# EAGLE design 504_outin_chirimen (EAGLE 9.6.2)
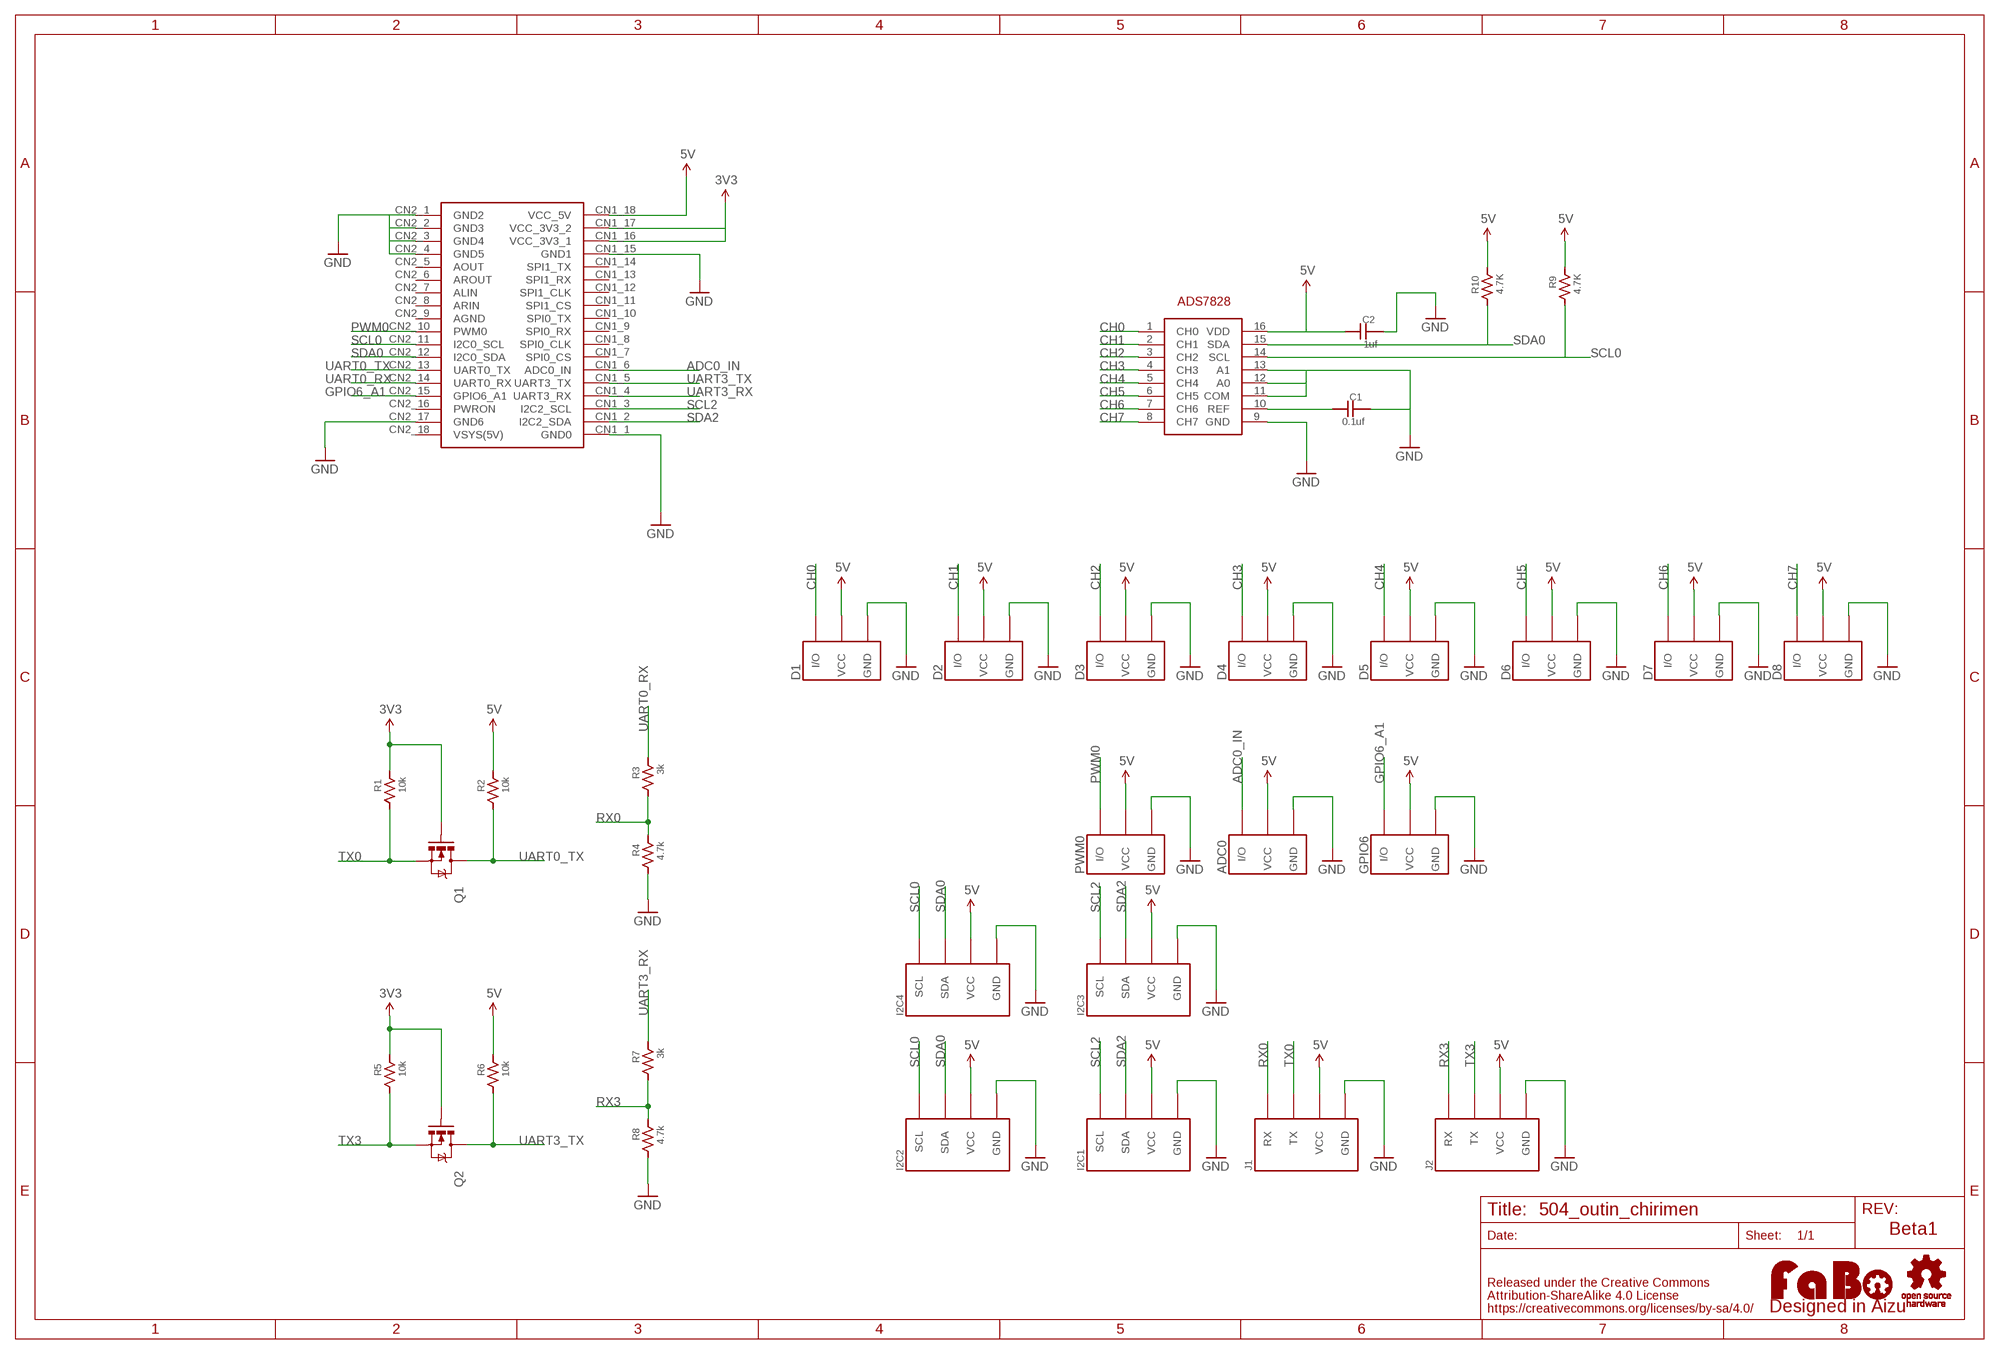
[diagram p0: schematic, sheet 1]

## Parts
ADC0  FABO_BRICK_3PIN-HEADER  [FABO_BRICK_3PIN_HEADER]
C1  0.1uf  CAPACITOR0402  [0402]
C2  1uf  CAPACITOR0402  [0402]
D1  FABO_BRICK_3PIN-B03B-PASK-1_SILK  [FABO_BRICK_3PIN_B03B-PASK-1_SILK]
D2  FABO_BRICK_3PIN-B03B-PASK-1_SILK  [FABO_BRICK_3PIN_B03B-PASK-1_SILK]
D3  FABO_BRICK_3PIN-B03B-PASK-1_SILK  [FABO_BRICK_3PIN_B03B-PASK-1_SILK]
D4  FABO_BRICK_3PIN-B03B-PASK-1_SILK  [FABO_BRICK_3PIN_B03B-PASK-1_SILK]
D5  FABO_BRICK_3PIN-B03B-PASK-1_SILK  [FABO_BRICK_3PIN_B03B-PASK-1_SILK]
D6  FABO_BRICK_3PIN-B03B-PASK-1_SILK  [FABO_BRICK_3PIN_B03B-PASK-1_SILK]
D7  FABO_BRICK_3PIN-B03B-PASK-1_SILK  [FABO_BRICK_3PIN_B03B-PASK-1_SILK]
D8  FABO_BRICK_3PIN-B03B-PASK-1_SILK  [FABO_BRICK_3PIN_B03B-PASK-1_SILK]
GPIO6  FABO_BRICK_3PIN-HEADER  [FABO_BRICK_3PIN_HEADER]
I2C1  FABO_BRICK_I2C-B04B-PASK-1_SILK  [FABO_BRICK_I2C_B04B-PASK-1_SILK]
I2C2  FABO_BRICK_I2C-B04B-PASK-1_SILK  [FABO_BRICK_I2C_B04B-PASK-1_SILK]
I2C3  FABO_BRICK_I2C-B04B-PASK-1_SILK  [FABO_BRICK_I2C_B04B-PASK-1_SILK]
I2C4  FABO_BRICK_I2C-B04B-PASK-1_SILK  [FABO_BRICK_I2C_B04B-PASK-1_SILK]
IC  TI-ADS7828  [TI-ADS7828]
J1  FABO_BRICK_SERIAL-S04B-PASK-2_SILK  [FABO_BRICK_SERIAL_S04B-PASK-2_SILK]
J2  FABO_BRICK_SERIAL-S04B-PASK-2_SILK  [FABO_BRICK_SERIAL_S04B-PASK-2_SILK]
LOGO1  LOGO_FABO-M  [LOGO_FABO_M]
PWM0  FABO_BRICK_3PIN-HEADER  [FABO_BRICK_3PIN_HEADER]
Q1  MOSFET-N-BSS138  [SOT23-3]
Q2  MOSFET-N-BSS138  [SOT23-3]
R1  10k  RESISTOR-0402  [0402]
R2  10k  RESISTOR-0402  [0402]
R3  3k  RESISTOR-0402  [0402]
R4  4.7k  RESISTOR-0402  [0402]
R5  10k  RESISTOR-0402  [0402]
R6  10k  RESISTOR-0402  [0402]
R7  3k  RESISTOR-0402  [0402]
R8  4.7k  RESISTOR-0402  [0402]
R9  4.7K  RESISTOR-0402  [0402]
R10  4.7K  RESISTOR-0402  [0402]
U$2  FABO-CHIRIMEN  [FABO-CHIRIMEN]
U$3  LOGO_OSHW-M_BOTTOM  [LOGO_OSHW_M_BOTTOM]

## Nets
3V3: Q1.1(G) Q2.1(G) R1.P$2 R5.P$2 U$2.CN1_16(VCC_3V3_1) U$2.CN1_17(VCC_3V3_2)
5V: ADC0.VCC C2.P$1 D1.VCC D2.VCC D3.VCC D4.VCC D5.VCC D6.VCC D7.VCC D8.VCC GPIO6.VCC I2C1.VCC I2C2.VCC I2C3.VCC I2C4.VCC IC.16(VDD) J1.VCC J2.VCC PWM0.VCC R2.P$2 R6.P$2 R9.P$2 R10.P$2 U$2.CN1_18(VCC_5V)
ADC0_IN: ADC0.I/O U$2.CN1_6(ADC0_IN)
CH0: D1.I/O IC.1(CH0)
CH1: D2.I/O IC.2(CH1)
CH2: D3.I/O IC.3(CH2)
CH3: D4.I/O IC.4(CH3)
CH4: D5.I/O IC.5(CH4)
CH5: D6.I/O IC.6(CH5)
CH6: D7.I/O IC.7(CH6)
CH7: D8.I/O IC.8(CH7)
GND: ADC0.GND C1.P$2 C2.P$2 D1.GND D2.GND D3.GND D4.GND D5.GND D6.GND D7.GND D8.GND GPIO6.GND I2C1.GND I2C2.GND I2C3.GND I2C4.GND IC.9(GND) IC.11(COM) IC.12(A0) IC.13(A1) J1.GND J2.GND PWM0.GND R4.P$1 R8.P$1 U$2.CN1_1(GND0) U$2.CN1_15(GND1) U$2.CN2_1(GND2) U$2.CN2_2(GND3) U$2.CN2_3(GND4) U$2.CN2_4(GND5) U$2.CN2_17(GND6)
GPIO6_A1: GPIO6.I/O U$2.CN2_15(GPIO6_A1)
N$3: C1.P$1 IC.10(REF)
PWM0: PWM0.I/O U$2.CN2_10(PWM0)
RX0: J1.RX R3.P$1 R4.P$2
RX3: J2.RX R7.P$1 R8.P$2
SCL0: I2C2.SCL I2C4.SCL IC.14(SCL) R9.P$1 U$2.CN2_11(I2C0_SCL)
SCL2: I2C1.SCL I2C3.SCL U$2.CN1_3(I2C2_SCL)
SDA0: I2C2.SDA I2C4.SDA IC.15(SDA) R10.P$1 U$2.CN2_12(I2C0_SDA)
SDA2: I2C1.SDA I2C3.SDA U$2.CN1_2(I2C2_SDA)
TX0: J1.TX Q1.2(S) R1.P$1
TX3: J2.TX Q2.2(S) R5.P$1
UART0_RX: R3.P$2 U$2.CN2_14(UART0_RX)
UART0_TX: Q1.3(D) R2.P$1 U$2.CN2_13(UART0_TX)
UART3_RX: R7.P$2 U$2.CN1_4(UART3_RX)
UART3_TX: Q2.3(D) R6.P$1 U$2.CN1_5(UART3_TX)
Unconnected: U$2.CN1_7(SPI0_CS) U$2.CN1_8(SPI0_CLK) U$2.CN1_9(SPI0_RX) U$2.CN1_10(SPI0_TX) U$2.CN1_11(SPI1_CS) U$2.CN1_12(SPI1_CLK) U$2.CN1_13(SPI1_RX) U$2.CN1_14(SPI1_TX) U$2.CN2_5(AOUT) U$2.CN2_6(AROUT) U$2.CN2_7(ALIN) U$2.CN2_8(ARIN) U$2.CN2_9(AGND) U$2.CN2_16(PWRON) U$2.CN2_18(VSYS(5V))

## Notes on the sheet
- Beta1

## Library data of the parts
ADC0 D1-D8 GPIO6 PWM0 = FaBo-Template:FABO_BRICK_3PIN: FaBo Brick 3pin
C1 C2 = FaBo-Capacitor:CAPACITOR: CAPACITOR
I2C1-I2C4 = FaBo-Template:FABO_BRICK_I2C: FaBo Brick I2C
IC = FaBo-ADC:TI-ADS7828
J1 J2 = FaBo-Template:FABO_BRICK_SERIAL: FaBo Brick Serial
LOGO1 = component:LOGO_FABO
Q1 Q2 = FaBo-etc:MOSFET-N
R1-R10 = FaBo-Resistors:RESISTOR: RESISTOR
U$2 = FaBo-Template:FABO-CHIRIMEN
U$3 = component:LOGO_OSHW

## Board
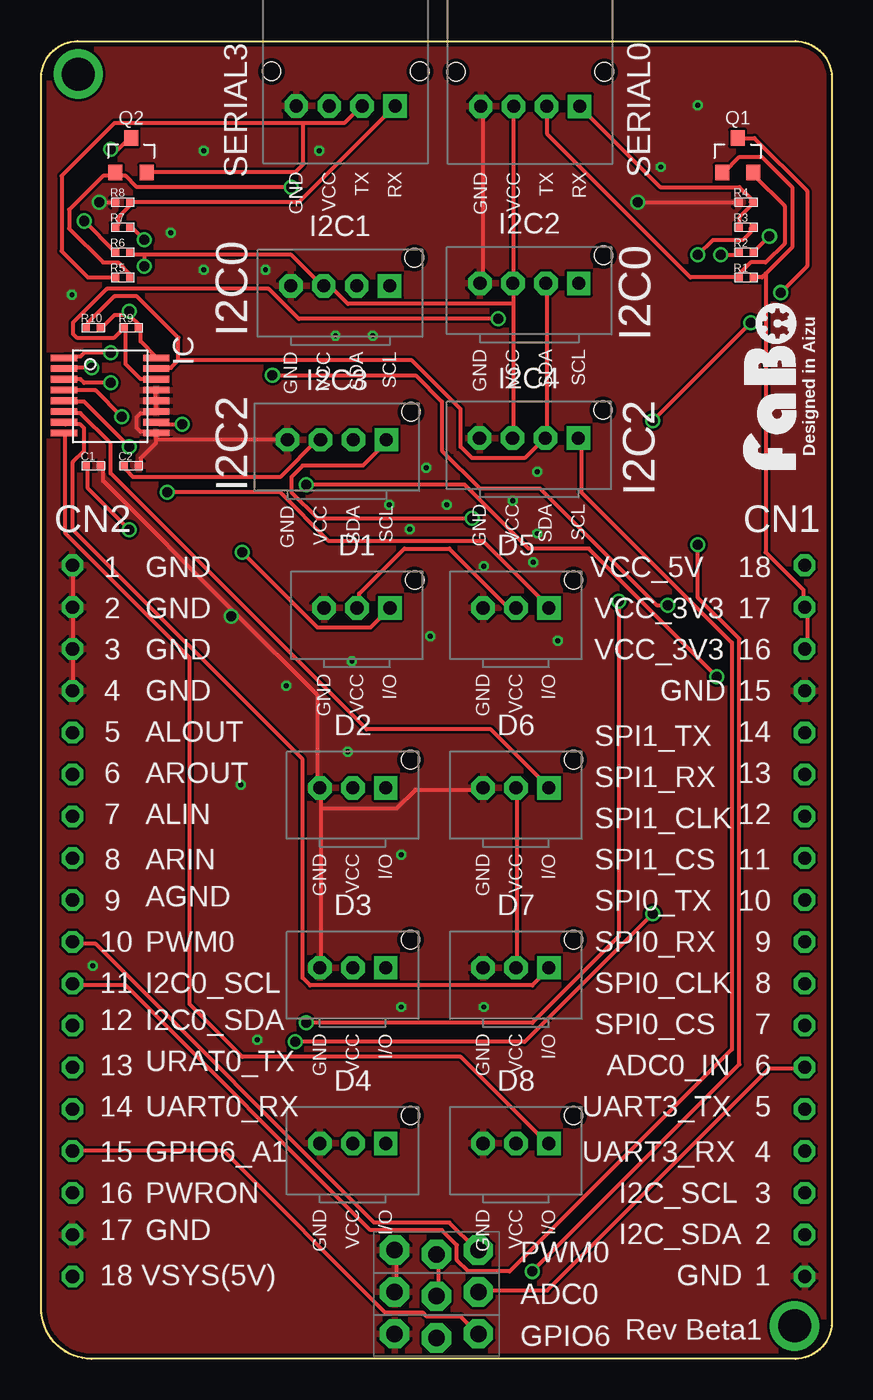
[diagram p1: board, top side]
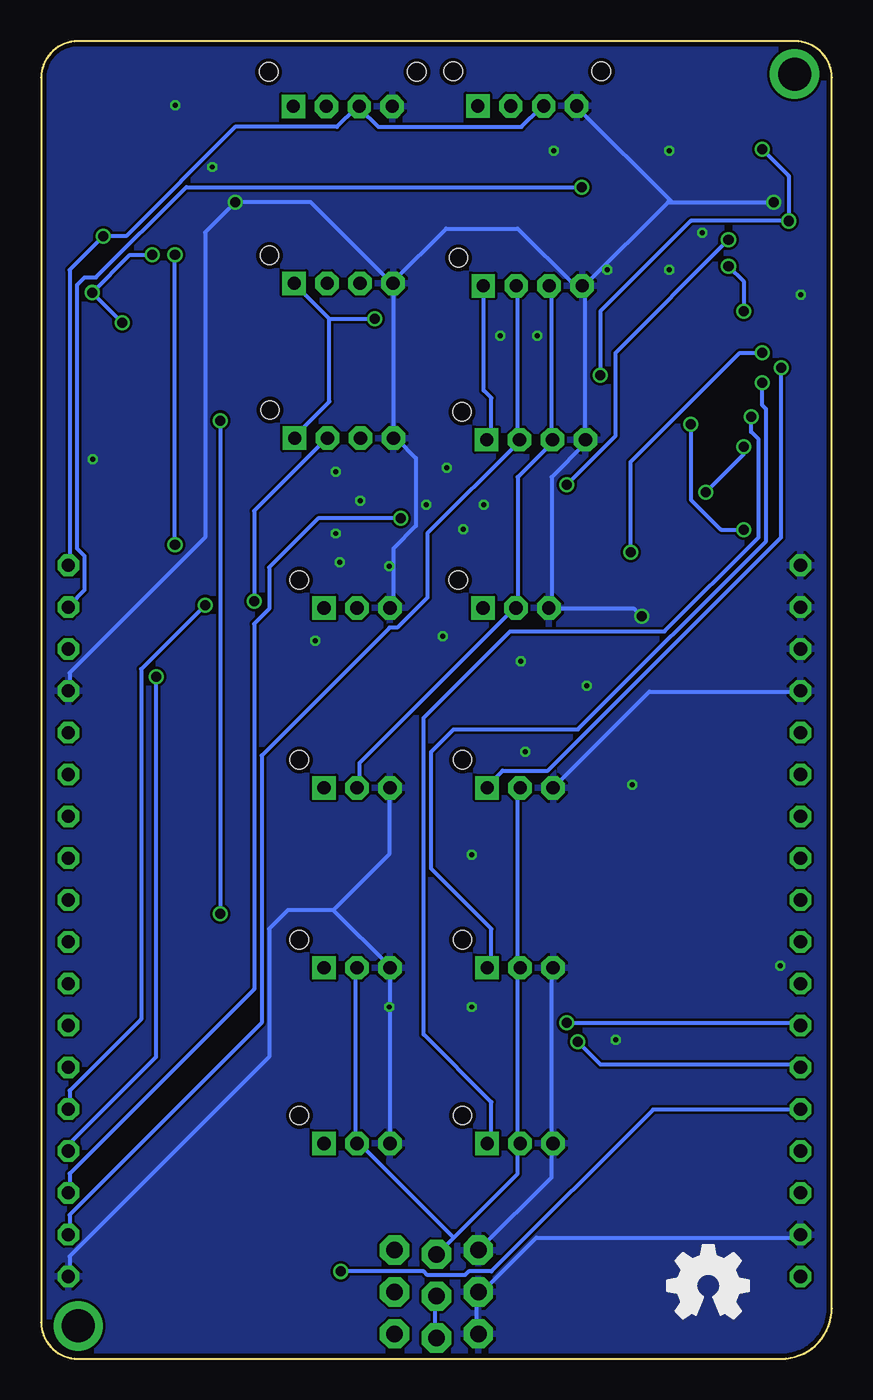
[diagram p2: board, bottom side, seen from below]

Size 48 x 80 mm. Coordinates in mm from the lower left corner, seen from the top.
Copper layers (1*16): Top 0.035mm / dielectric 1.6mm / Bottom 0.035mm
Design rules "PCBway": minimum track width 6mil, minimum drill 12mil, track to track 6mil, track to pad 6mil, pad to pad 6mil, via to via 6mil, smd to smd 6mil, copper to edge 10mil, drill to drill 10mil, minimum pad ring 10mil, minimum via ring 6mil, stop-mask expansion 2mil, vias tented up to drill 100mil, thermal gap 8mil

### Footprints (pad centres in the part's own frame; a part is rotated, then mirrored left to right if it is on the bottom)
FABO_BRICK_3PIN_HEADER = drill 1 pad 1.778 octagon: GND -2.54,0.127; I/O 2.54,0.127; VCC 0,-0.127
0402 = smd 0.5 x 0.5: P$1 -0.46,0; P$2 0.46,0
FABO_BRICK_3PIN_B03B-PASK-1_SILK = drill 0.8 pad 1.422 octagon: GND -2,0; VCC 0,0 | drill 0.8 pad 1.422 square: I/O 2,0 | hole 1.1: 3.5,1.7
FABO_BRICK_I2C_B04B-PASK-1_SILK = drill 0.8 pad 1.422 octagon: GND -3,0; SDA 1,0; VCC -1,0 | drill 0.8 pad 1.422 square: SCL 3,0 | hole 1.1: 4.5,1.7
TI-ADS7828 = smd 0.35 x 1.6: 1 -2.48,-2.8; 2 -1.83,-2.8; 3 -1.18,-2.8; 4 -0.53,-2.8; 5 0.12,-2.8; 6 0.77,-2.8; 7 1.42,-2.8; 8 2.07,-2.8; 9 2.07,2.8; 10 1.42,2.8; 11 0.77,2.8; 12 0.12,2.8; 13 -0.53,2.8; 14 -1.18,2.8; 15 -1.83,2.8; 16 -2.48,2.8
FABO_BRICK_SERIAL_S04B-PASK-2_SILK = drill 0.8 pad 1.422 octagon: GND -3,0; TX 1,0; VCC -1,0 | drill 0.8 pad 1.422 square: RX 3,0 | hole 1.1: 4.5,2.1; -4.5,2.1
SOT23-3 = smd 0.85 x 0.95: 1 -0.95,-1; 2 0.95,-1; 3 0,1.1
FABO-CHIRIMEN = drill 0.8 octagon: CN1_1 22.35,-35; CN1_2 22.35,-32.46; CN1_3 22.35,-29.92; CN1_4 22.35,-27.38; CN1_5 22.35,-24.84; CN1_6 22.35,-22.3; CN1_7 22.35,-19.76; CN1_8 22.35,-17.22; CN1_9 22.35,-14.68; CN1_10 22.35,-12.14; CN1_11 22.35,-9.6; CN1_12 22.35,-7.06; CN1_13 22.35,-4.52; CN1_14 22.35,-1.98; CN1_15 22.35,0.56; CN1_16 22.35,3.1; CN1_17 22.35,5.64; CN1_18 22.35,8.18; CN2_1 -22.1,8.18; CN2_2 -22.1,5.64; CN2_3 -22.1,3.1; CN2_4 -22.1,0.56; CN2_5 -22.1,-1.98; CN2_6 -22.1,-4.52; CN2_7 -22.1,-7.06; CN2_8 -22.1,-9.6; CN2_9 -22.1,-12.14; CN2_10 -22.1,-14.68; CN2_11 -22.1,-17.22; CN2_12 -22.1,-19.76; CN2_13 -22.1,-22.3; CN2_14 -22.1,-24.84; CN2_15 -22.1,-27.38; CN2_16 -22.1,-29.92; CN2_17 -22.1,-32.46; CN2_18 -22.1,-35 | drill 2: P$1 21.75,-38; P$2 -21.75,38

### Placement (x,y rotation side)
ADC0  24,3.93 0 top
C1  3.17,54.22 0 top
C2  5.46,54.22 0 top
D1  19.17,45.59 0 top
D2  18.92,34.67 0 top
D3  18.92,23.74 0 top
D4  18.92,13.08 0 top
D5  28.83,45.59 0 top
D6  28.83,34.67 0 top
D7  28.83,23.74 0 top
D8  28.83,13.08 0 top
GPIO6  24,1.39 0 top
I2C1  18.16,65.15 0 top
I2C2  29.64,65.3 0 top
I2C3  17.95,55.8 0 top
I2C4  29.61,55.9 0 top
IC  4.19,58.29 270 top
J1  29.69,76.04 0 top
J2  18.49,76.07 0 top
LOGO1  46.22,59.05 90 top
PWM0  24,6.47 0 top
Q1  42.29,73.02 0 top
Q2  5.46,73.02 0 top
R1  42.8,65.65 0 top
R2  42.8,67.18 0 top
R3  42.8,68.7 0 top
R4  42.8,70.23 0 top
R5  4.95,65.65 0 top
R6  4.95,67.18 0 top
R7  4.95,68.7 0 top
R8  4.95,70.23 0 top
R9  5.46,62.61 0 top
R10  3.17,62.61 0 top
U$2  24,40 0 top
U$3  7.49,4.44 0 top

### Tracks (layer width: path | path; a pad name or v marks a point on that pad's centre or on a via)
3V3  (via drill 0.61)
  Top 0.254: R5.P$2 5.36,65.65 5.36,65.88 4.67,66.57 3.76,66.57 1.7,68.63 1.7,69.77 3.76,71.83 4.44,71.83 Q2.1 4.67,71.83 5.13,71.83 5.81,71.14 v15.19,71.14 | U$2.CN1_16 46.5,43.25 46.5,45.54 U$2.CN1_17 46.28,45.77 46.28,46.68 43.99,48.97 43.99,65.88 | R1.P$2 43.76,65.65 43.99,65.88 | 43.99,65.88 45.59,67.48 45.59,71.14 43.76,72.97 42.39,72.97 41.47,72.05 Q1.1
  Bottom 0.254: v15.19,71.14 39.19,71.14 44.68,65.65 45.36,65.65 45.82,65.2 45.82,49.2 45.36,48.74 45.36,46.68 46.28,45.77 U$2.CN1_17
5V  (via drill 0.61)
  Top 0.254: D6.VCC 28.9,34.56 28.9,23.82 D7.VCC | ADC0.VCC 24.1,3.93 24.1,6.22 PWM0.VCC | 5.36,63.37 4.44,63.37 3.76,62.68 R10.P$2 | 5.36,63.37 6.04,62.68 R9.P$2 6.04,62.45 6.04,61.77 6.96,60.85 IC.16 | 6.27,67.03 15.19,67.03 17.02,65.2 I2C1.VCC 17.24,64.97 17.7,64.97 18.62,64.05 28.67,64.05 | 6.27,67.03 5.59,67.03 R6.P$2 | v5.36,63.6 5.36,63.37 | 6.27,67.03 v6.27,66.34 | C2.P$1 5.13,54.22 5.13,53.99 5.59,53.54 14.5,53.54 16.79,55.82 I2C3.VCC | D5.VCC 28.67,45.77 28.22,45.77 24.79,49.2 22.04,49.2 19.3,46.45 19.3,45.77 D1.VCC | 28.67,64.05 28.67,65.2 I2C2.VCC 28.67,65.42 28.67,75.94 J1.VCC | 28.67,64.05 28.67,56.05 I2C4.VCC | v44.22,68.17 43.3,67.25 R2.P$2
  Bottom 0.254: GPIO6.VCC 24.1,1.42 24.1,3.7 ADC0.VCC | 19.07,13.08 19.07,11.25 22.96,7.36 | 22.96,7.36 23.87,6.45 PWM0.VCC | 19.07,13.08 19.07,23.59 D3.VCC 19.07,23.82 19.07,34.56 D2.VCC | 19.07,13.08 D4.VCC | 22.96,7.36 28.67,13.08 D8.VCC 28.9,13.08 28.9,23.59 D7.VCC | v5.36,63.6 5.36,65.42 v6.27,66.34 | I2C1.VCC 17.02,64.97 17.02,55.82 I2C3.VCC 17.02,55.6 19.07,53.54 19.07,45.77 D1.VCC 19.3,45.54 28.67,36.16 28.67,34.79 D6.VCC | U$2.CN1_18 46.28,48.28 46.28,66.11 v44.22,68.17 42.85,68.17 36.22,74.8 30.05,74.8 28.9,75.94 J1.VCC 28.67,75.94 27.53,74.8 18.84,74.8 17.7,75.94 J2.VCC
ADC0_IN
  Top 0.254: U$2.CN1_6 46.28,17.65 44.22,17.65 30.73,4.16 26.62,4.16 ADC0.I/O
CH0  (via drill 0.61)
  Top 0.254: v4.21,61.08 2.61,61.08 2.39,60.85 1.47,60.85 IC.1 | v12.21,48.97 16.79,44.39 19.99,44.39 21.13,45.54 D1.I/O
  Bottom 0.254: v4.21,61.08 5.59,61.08 12.21,54.45 v12.21,48.97
CH1  (via drill 0.61)
  Top 0.254: v3.07,60.17 1.47,60.17 IC.2
  Bottom 0.254: v3.07,60.17 3.07,49.88 17.24,35.71 19.99,35.71 20.9,34.79 D2.I/O
CH2  (via drill 0.61)
  Top 0.254: v4.21,59.25 2.61,59.25 2.39,59.48 1.47,59.48 IC.3
  Bottom 0.254: v4.21,59.25 4.21,57.88 3.99,57.65 3.99,49.65 15.42,38.22 22.96,38.22 24.33,36.85 24.33,29.76 20.67,26.11 20.67,24.05 20.9,23.82 D3.I/O
CH3  (via drill 0.61)
  Top 0.254: v4.9,57.2 3.3,58.8 1.47,58.8 IC.4
  Bottom 0.254: v4.9,57.2 4.9,56.28 4.44,55.82 4.44,49.88 10.16,44.17 19.53,44.17 24.79,38.91 24.79,19.7 20.67,15.59 20.67,13.3 20.9,13.08 D4.I/O
CH4  (via drill 0.61)
  Top 0.254: v5.36,55.37 2.61,58.11 1.47,58.11 IC.5 | v7.64,52.62 14.5,52.62 17.47,49.65 26.85,49.65 30.73,45.77 D5.I/O
  Bottom 0.254: v5.36,55.37 5.36,54.91 v7.64,52.62
CH5
  Top 0.254: IC.6 1.47,57.42 2.39,57.42 4.21,55.6 4.21,53.77 19.76,38.22 27.3,38.22 30.73,34.79 D6.I/O
CH6
  Top 0.254: IC.7 1.47,56.74 2.39,56.74 2.61,56.51 2.61,55.14 1.93,54.45 1.93,50.34 15.87,36.39 15.87,23.13 16.33,22.68 29.82,22.68 30.73,23.59 D7.I/O
CH7
  Top 0.254: IC.8 1.47,56.05 1.47,50.11 9.01,42.56 9.01,21.53 12.21,18.33 25.47,18.33 30.73,13.08 D8.I/O
GND  (via drill 0.3, 0.61)
  Top 0.254: v3.53,70.23 R8.P$1 | IC.13 6.96,58.8 6.96,58.34 IC.12 6.96,58.11 6.96,57.65 IC.11 6.96,57.42 6.04,57.42 5.81,57.2 5.81,56.51 6.04,56.28 6.96,56.28 IC.9 6.96,56.05 6.96,55.82 | 6.96,55.82 6.96,55.6 6.04,54.68 6.04,54.22 C2.P$2 | 6.96,55.82 14.73,55.82 I2C3.GND | v36.22,70.23 R4.P$1 | J1.GND 26.85,75.94 26.85,65.42 I2C2.GND | U$2.CN2_4 1.93,40.74 1.93,43.02 U$2.CN2_3 1.93,43.25 1.93,45.54 U$2.CN2_2 1.93,45.77 1.93,48.05 U$2.CN2_1 | 11.76,45.31 16.79,40.28 16.79,34.79 D2.GND 17.02,34.56 17.02,33.42 | 11.76,45.31 3.76,53.31 3.76,54.22 C1.P$2 | PWM0.GND 21.59,6.45 21.59,4.16 ADC0.GND | 17.02,33.42 17.02,23.82 D3.GND | 17.02,33.42 21.59,33.42 22.73,34.56 26.62,34.56 D6.GND | 11.76,45.31 v11.53,45.08
  Bottom 0.254: 9.7,70.23 9.93,70.23 14.96,65.2 I2C1.GND | 9.7,70.23 v3.53,70.23 | 9.7,70.23 15.42,75.94 J2.GND | I2C1.GND 14.96,64.97 14.96,55.82 I2C3.GND 14.96,55.6 17.02,53.54 17.02,45.77 D1.GND 17.02,45.54 11.99,45.54 v11.53,45.08 | I2C2.GND 26.85,65.42 31.64,70.23 v36.22,70.23 38.05,68.4 38.05,49.88 46.28,41.65 46.28,40.74 U$2.CN1_15 | I2C2.GND 26.62,65.2 26.62,56.05 I2C4.GND 26.39,55.82 25.25,54.68 25.25,50.57 26.62,49.2 26.62,45.77 D5.GND | I2C1.GND 15.19,65.2 15.64,65.2 19.07,68.63 23.42,68.63 26.62,65.42 I2C2.GND | 30.27,27.25 33.02,27.25 34.16,26.11 34.16,18.33 46.28,6.22 46.28,5.07 U$2.CN1_1 | 30.27,27.25 26.85,23.82 D7.GND 26.85,23.59 26.85,13.08 D8.GND | 30.27,27.25 26.85,30.68 26.85,34.56 D6.GND | U$2.CN2_4 1.93,40.51 11.07,40.51 16.79,34.79 D2.GND | 17.02,13.08 17.02,11.02 21.36,6.67 PWM0.GND | 17.02,13.08 17.02,23.59 D3.GND | 17.02,13.08 D4.GND | U$2.CN2_17 1.93,7.36 17.93,7.36 21.36,3.93 ADC0.GND 21.59,3.93 21.59,1.65 GPIO6.GND
  other vias: 9.87,73.36 16.87,73.36 7.87,68.36 37.62,72.36 39.87,76.11 23.37,54.11 21.12,51.86 24.62,51.86 12.12,34.86 13.12,19.36 21.87,21.36 26.87,21.36 30.12,53.86 29.87,48.36 26.87,48.11 9.87,66.11 13.62,66.11 44.87,54.61 23.62,43.86 18.87,42.36 14.87,40.86 31.37,43.61 21.87,30.61 18.62,36.86 28.62,52.11 30.12,50.11 22.37,50.36 20.12,62.11 17.87,62.11 1.87,64.61 3.12,23.86
  pour Bottom: -0.13,-0.64 48.87,-0.64 48.87,80.36 -0.13,80.36
  pour Top: -0.13,-0.64 48.87,-0.64 48.87,80.36 -0.13,80.36
GPIO6_A1
  Top 0.254: U$2.CN2_15 1.93,12.62 11.07,12.62 20.9,2.79 23.19,2.79 23.42,2.56 25.47,2.56 26.39,1.65 GPIO6.I/O
N$3  (via drill 0.61)
  Top 0.254: v5.36,50.34 2.84,52.85 2.84,54.22 C1.P$1 | v8.56,56.74 7.19,56.74 IC.10
  Bottom 0.254: v5.36,50.34 6.73,50.34 8.56,52.17 v8.56,56.74
PWM0
  Top 0.254: U$2.CN2_10 1.93,25.19 3.3,25.19 20.21,8.27 24.79,8.27 26.39,6.67 PWM0.I/O
RX0
  Top 0.254: R3.P$1 42.39,68.85 42.39,69.31 43.3,70.23 R4.P$2 43.08,70.23 43.08,70.45 42.39,71.14 37.59,71.14 32.79,75.94 J1.RX
RX3
  Top 0.254: 5.59,70.23 4.67,69.31 4.67,68.85 R7.P$1 | 5.59,70.23 15.64,70.23 21.36,75.94 J2.RX | 5.59,70.23 R8.P$2
SCL0  (via drill 0.61)
  Top 0.254: IC.14 6.96,59.48 6.04,59.48 5.13,60.4 5.13,62.45 R9.P$1 4.9,62.45 4.44,62 2.16,62 1.93,62.23 1.93,62.91 3.99,64.97 13.82,64.97 15.64,63.14 v27.76,63.14 | U$2.CN2_11 1.93,22.68 5.13,22.68 19.99,7.82 24.33,7.82 25.25,6.9 25.25,5.99 25.93,5.3 28.45,5.3 41.93,18.79 41.93,43.48 32.79,52.62 32.79,55.82 I2C4.SCL
  Bottom 0.254: 30.5,63.14 v27.76,63.14 | 30.5,63.14 32.56,65.2 I2C2.SCL | 30.5,63.14 30.5,58.11 32.56,56.05 I2C4.SCL
SCL2  (via drill 0.61)
  Top 0.254: v26.16,51.02 16.79,51.02 15.19,52.62 15.19,53.54 15.87,54.22 19.53,54.22 20.9,55.6 I2C3.SCL
  Bottom 0.254: v26.16,51.02 31.19,51.02 34.16,48.05 34.16,45.54 35.07,44.62 35.07,22.45 46.28,11.25 46.28,10.1 U$2.CN1_3 | I2C1.SCL 21.13,64.97 21.13,58.8 20.67,58.34 20.67,56.05 20.9,55.82 I2C3.SCL
SDA0  (via drill 0.61)
  Top 0.254: 8.33,60.62 8.33,62 5.81,64.51 4.44,64.51 2.84,62.91 2.84,62.68 R10.P$1 | 8.33,60.62 7.87,60.17 7.19,60.17 IC.15 | v16.1,20.39 29.82,20.39 35.07,25.65 v35.07,45.99 | I2C2.SDA 30.73,65.2 30.73,56.05 I2C4.SDA 30.5,55.82 29.36,54.68 26.16,54.68 25.47,55.37 25.47,57.65 22.5,60.62 8.33,60.62
  Bottom 0.254: v16.1,20.39 1.93,20.39 U$2.CN2_12 | v35.07,45.99 35.07,51.48 30.73,55.82 I2C4.SDA
SDA2
  Bottom 0.254: U$2.CN1_2 46.28,7.59 46.28,8.73 34.62,20.39 34.62,36.62 26.85,44.39 26.39,44.39 24.56,46.22 24.56,50.11 19.07,55.6 I2C3.SDA 19.07,55.82 19.07,64.97 I2C1.SDA
TX0
  Top 0.254: Q1.2 43.3,71.83 45.13,70 45.13,67.71 43.99,66.57 43.08,66.57 42.39,65.88 42.39,65.65 R1.P$1 39.42,65.65 30.73,74.34 30.73,75.94 J1.TX
TX3
  Top 0.254: R5.P$1 2.84,65.65 1.24,67.25 1.24,71.83 4.44,75.03 15.87,75.03 | 15.87,75.03 18.39,75.03 19.3,75.94 J2.TX | 15.87,75.03 15.87,72.51 15.42,72.05 6.5,72.05 Q2.2
UART0_RX  (via drill 0.61)
  Top 0.254: v39.88,67.03 40.79,67.94 42.62,67.94 43.08,68.4 43.08,68.63 R3.P$2 | v39.88,49.42 39.88,46.22 42.39,43.71 42.39,17.88 v29.82,5.3
  Bottom 0.254: v39.88,49.42 v39.88,67.03 | v29.82,5.3 24.79,5.3 24.56,5.07 22.27,5.07 22.04,5.3 20.67,5.3 10.84,15.13 1.93,15.13 U$2.CN2_14
UART0_TX  (via drill 0.61)
  Top 0.254: v41.25,67.03 42.16,67.03 R2.P$1 | v44.9,64.74 46.5,66.34 46.5,70.91 43.3,74.11 42.39,74.11 Q1.3 | v15.42,19.25 29.36,19.25 v37.13,27.02 | v43.08,62.91 v37.13,56.97
  Bottom 0.254: v41.25,67.03 42.62,67.03 v44.9,64.74 v43.08,62.91 | v15.42,19.25 14.04,17.88 1.93,17.88 U$2.CN2_13 | v37.13,56.97 v37.13,27.02
UART3_RX  (via drill 0.61)
  Top 0.254: v6.27,67.94 5.59,68.63 R7.P$2 | v16.1,53.08 25.7,53.08 29.59,49.2 33.25,49.2 v41.02,41.42
  Bottom 0.254: v6.27,67.94 13.13,61.08 13.13,56.05 v16.1,53.08 | v41.02,41.42 41.02,18.33 46.5,12.85 U$2.CN1_4
UART3_TX  (via drill 0.61)
  Top 0.254: v2.61,69.08 4.44,67.25 R6.P$1 | v4.21,73.43 4.67,73.43 5.36,74.11 Q2.3 | v38.05,45.77 37.36,45.77 30.27,52.85 26.62,52.85 24.33,55.14 24.33,58.11 22.73,59.71 v14.04,59.71
  Bottom 0.254: v4.21,73.43 2.61,71.83 v2.61,69.08 8.56,69.08 14.04,63.6 v14.04,59.71 | v38.05,45.77 41.93,41.88 41.93,20.62 46.28,16.28 46.28,15.36 U$2.CN1_5

### Text on the board
tPlace: SERIAL3 | SERIAL0 | I2C0 | I2C0 | Designed in Aizu | I2C2 | I2C2 | Rev Beta1